# Altium schematic sheet MAIN_DRIVER.SchDoc
size A3; SheetNumber: 1; SheetTotal: 3
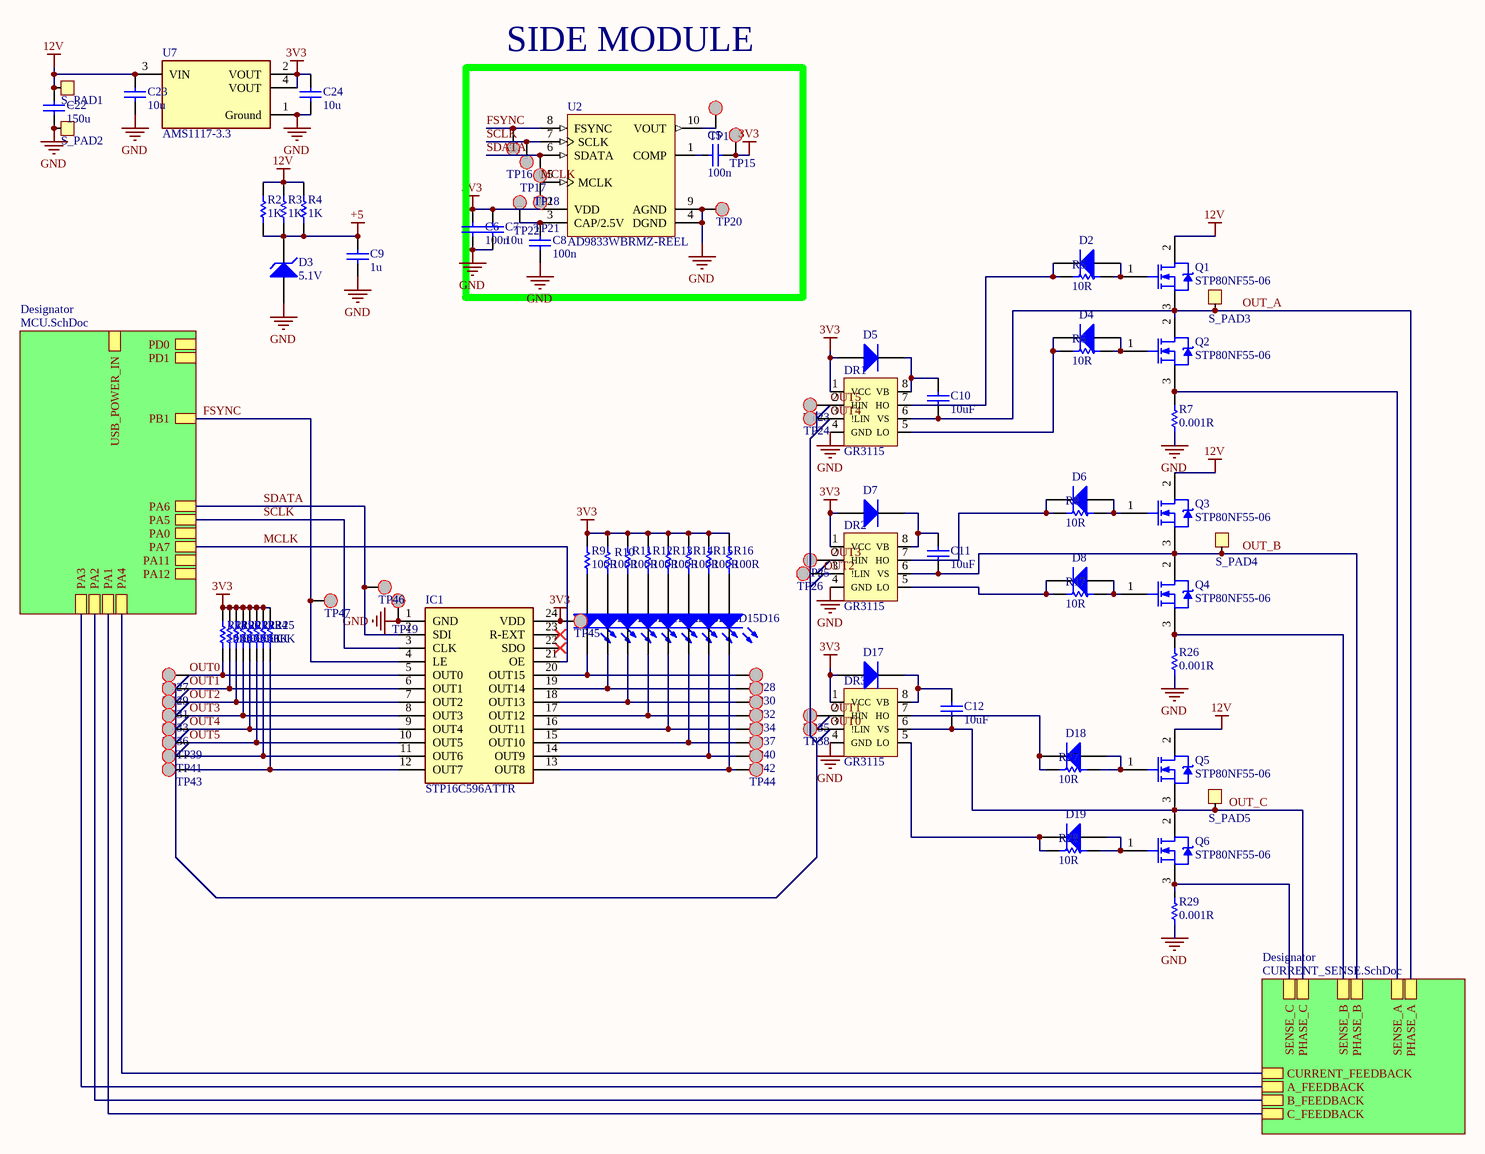
[diagram p0: MAIN_DRIVER.SchDoc]

## Parts
C5  value 100n  [CAP FILM 0603_1608]  (hidden comment: Capacitor)
C6  value 100n  [CAP FILM 0603_1608]  (hidden comment: Capacitor)
C7  value 10u  [CAP FILM 0603_1608]  (hidden comment: Capacitor)
C8  value 100n  [CAP FILM 0603_1608]  (hidden comment: Capacitor)
C9  value 1u  [CAP FILM 0603_1608]  (hidden comment: Capacitor)
C10  value 10uF  [CAP FILM 0603_1608]  (hidden comment: Capacitor)
C11  value 10uF  [CAP FILM 0603_1608]  (hidden comment: Capacitor)
C12  value 10uF  [CAP FILM 0603_1608]  (hidden comment: Capacitor)
C22  value 150u  [CAPAE7266X80M]  (hidden comment: Capacitor)
C23  value 10u  [CAP FILM 0805]  (hidden comment: Capacitor)
C24  value 10u  [CAP FILM 0805]  (hidden comment: Capacitor)
D2  1N4148  [SODFL375X135-2N]  (value not drawn)
D3  BV: 5.1V  [DIOMELF3514N]  (hidden comment: Zener Diode)
D4  1N4148  [SODFL375X135-2N]  (value not drawn)
D5  Diode  [SODFL365X110-2N]  (value not drawn)
D6  1N4148  [SODFL375X135-2N]  (value not drawn)
D7  Diode  [SODFL365X110-2N]  (value not drawn)
D8  1N4148  [SODFL375X135-2N]  (value not drawn)
D9  Light-Emitting Diode  [RES 0603_1608]  (value not drawn)
D10  Light-Emitting Diode  [RES 0603_1608]  (value not drawn)
D11  Light-Emitting Diode  [RES 0603_1608]  (value not drawn)
D12  Light-Emitting Diode  [RES 0603_1608]  (value not drawn)
D13  Light-Emitting Diode  [RES 0603_1608]  (value not drawn)
D14  Light-Emitting Diode  [RES 0603_1608]  (value not drawn)
D15  Light-Emitting Diode  [RES 0603_1608]  (value not drawn)
D16  Light-Emitting Diode  [RES 0603_1608]  (value not drawn)
D17  Diode  [SODFL365X110-2N]  (value not drawn)
D18  1N4148  [SODFL375X135-2N]  (value not drawn)
D19  1N4148  [SODFL375X135-2N]  (value not drawn)
DR1  GR3115  [PCBComponent_1]
DR2  GR3115  [PCBComponent_1]
DR3  GR3115  [PCBComponent_1]
IC1  STP16C596ATTR  [SOP65P638X110-24N]
Q1  STP80NF55-06  [STM-TO-220A-3]
Q2  STP80NF55-06  [STM-TO-220A-3]
Q3  STP80NF55-06  [STM-TO-220A-3]
Q4  STP80NF55-06  [STM-TO-220A-3]
Q5  STP80NF55-06  [STM-TO-220A-3]
Q6  STP80NF55-06  [STM-TO-220A-3]
R2  value 1K  [RES 0603_1608]  (hidden comment: Resistor)
R3  value 1K  [RES 0603_1608]  (hidden comment: Resistor)
R4  value 1K  [RES 0603_1608]  (hidden comment: Resistor)
R5  value 10R  [RES 0603_1608]  (hidden comment: Resistor)
R6  value 10R  [RES 0603_1608]  (hidden comment: Resistor)
R7  value 0.001R  [RES 1206_3216]  (hidden comment: Resistor)
R8  value 10R  [RES 0603_1608]  (hidden comment: Resistor)
R9  value 100R  [RES 0603_1608]  (hidden comment: Resistor)
R10  value 100R  [RES 0603_1608]  (hidden comment: Resistor)
R11  value 100R  [RES 0603_1608]  (hidden comment: Resistor)
R12  value 100R  [RES 0603_1608]  (hidden comment: Resistor)
R13  value 100R  [RES 0603_1608]  (hidden comment: Resistor)
R14  value 100R  [RES 0603_1608]  (hidden comment: Resistor)
R15  value 100R  [RES 0603_1608]  (hidden comment: Resistor)
R16  value 100R  [RES 0603_1608]  (hidden comment: Resistor)
R17  value 10R  [RES 0603_1608]  (hidden comment: Resistor)
R18  value 10K  [RES 0603_1608]  (hidden comment: Resistor)
R19  value 10K  [RES 0603_1608]  (hidden comment: Resistor)
R20  value 10K  [RES 0603_1608]  (hidden comment: Resistor)
R21  value 10K  [RES 0603_1608]  (hidden comment: Resistor)
R22  value 10K  [RES 0603_1608]  (hidden comment: Resistor)
R23  value 10K  [RES 0603_1608]  (hidden comment: Resistor)
R24  value 10K  [RES 0603_1608]  (hidden comment: Resistor)
R25  value 10K  [RES 0603_1608]  (hidden comment: Resistor)
R26  value 0.001R  [RES 1206_3216]  (hidden comment: Resistor)
R27  value 10R  [RES 0603_1608]  (hidden comment: Resistor)
R28  value 10R  [RES 0603_1608]  (hidden comment: Resistor)
R29  value 0.001R  [RES 1206_3216]  (hidden comment: Resistor)
S_PAD1  SOLDER_PAD  [POWER_PAD]  (value not drawn)
S_PAD2  SOLDER_PAD  [POWER_PAD]  (value not drawn)
S_PAD3  SOLDER_PAD  [POWER_PAD]  (value not drawn)
S_PAD4  SOLDER_PAD  [POWER_PAD]  (value not drawn)
S_PAD5  SOLDER_PAD  [POWER_PAD]  (value not drawn)
TP14  (no value)  [ROUND_SMALL]
TP15  (no value)  [ROUND_SMALL]
TP16  (no value)  [ROUND_SMALL]
TP17  (no value)  [ROUND_SMALL]
TP18  (no value)  [ROUND_SMALL]
TP19  (no value)  [ROUND_SMALL]
TP20  (no value)  [ROUND_SMALL]
TP21  (no value)  [ROUND_SMALL]
TP22  (no value)  [ROUND_SMALL]
TP23  (no value)  [ROUND_SMALL]
TP24  (no value)  [ROUND_SMALL]
TP25  (no value)  [ROUND_SMALL]
TP26  (no value)  [ROUND_SMALL]
TP27  (no value)  [ROUND_SMALL]
TP28  (no value)  [ROUND_SMALL]
TP29  (no value)  [ROUND_SMALL]
TP30  (no value)  [ROUND_SMALL]
TP31  (no value)  [ROUND_SMALL]
TP32  (no value)  [ROUND_SMALL]
TP33  (no value)  [ROUND_SMALL]
TP34  (no value)  [ROUND_SMALL]
TP35  (no value)  [ROUND_SMALL]
TP36  (no value)  [ROUND_SMALL]
TP37  (no value)  [ROUND_SMALL]
TP38  (no value)  [ROUND_SMALL]
TP39  (no value)  [ROUND_SMALL]
TP40  (no value)  [ROUND_SMALL]
TP41  (no value)  [ROUND_SMALL]
TP42  (no value)  [ROUND_SMALL]
TP43  (no value)  [ROUND_SMALL]
TP44  (no value)  [ROUND_SMALL]
TP45  (no value)  [ROUND_SMALL]
TP46  (no value)  [ROUND_SMALL]
TP47  (no value)  [ROUND_SMALL]
U2  AD9833WBRMZ-REEL  [ADI-RM-10_M]
U7  AMS1117-3.3  [FP-AMS1117-IPC_C]

## Blocks framed on the sheet
SIDE MODULE: C5-C8 TP14-TP18 TP20-TP22 U2

## Sub-sheets
Designator = MCU.SchDoc: USB_POWER_IN, PD0, PD1, PB1, PA5, PA6, PA7, PA11, PA12, PA1, PA2, PA3, PA4, PA0
Designator = CURRENT_SENSE.SchDoc: SENSE_A, SENSE_B, SENSE_C, PHASE_A, PHASE_B, PHASE_C, CURRENT_FEEDBACK, A_FEEDBACK, B_FEEDBACK, C_FEEDBACK

## Nets
3V3: C5.2 C6.2 C7.1 C24.2 D5.1(A) D7.1(A) D17.1(A) DR1.1(VCC) DR2.1(VCC) DR3.1(VCC) IC1.24(VDD) R9.2 R10.2 R11.2 R12.2 R13.2 R14.2 R15.2 R16.2 R18.2 R19.2 R20.2 R21.2 R22.2 R23.2 R24.2 R25.2 TP15.1(Test_Point) TP45.1(Test_Point) U2.2(VDD) U7.2(VOUT) U7.4(VOUT)
12V: C22.2 C23.2 Q1.2(D) Q3.2(D) Q5.2(D) R2.2 R3.2 R4.2 S_PAD1.1 U7.3(VIN)
+5: C9.2 D3.2(K) R2.1 R3.1 R4.1
GND: C6.1 C7.2 C8.1 C9.1 C22.1 C23.1 C24.1 D3.1(A) DR1.4(GND) DR2.4(GND) DR3.4(GND) IC1.1(GND) R7.1 R26.1 R29.1 S_PAD2.1 TP19.1(Test_Point) TP20.1(Test_Point) U2.4(DGND) U2.9(AGND) U7.1(Ground)
FSYNC: IC1.4(LE) TP16.1(Test_Point) TP47.1(Test_Point) U2.8(FSYNC) ; sheet Designator/PB1
MCLK: IC1.21(OE) TP21.1(Test_Point) U2.5(MCLK) ; sheet Designator/PA7
OUT0: DR3.3(!LIN) IC1.5(OUT0) R18.1 TP27.1(Test_Point) TP38.1(Test_Point)
OUT1: DR3.2(HIN) IC1.6(OUT1) R19.1 TP29.1(Test_Point) TP35.1(Test_Point)
OUT2: DR2.3(!LIN) IC1.7(OUT2) R20.1 TP26.1(Test_Point) TP31.1(Test_Point)
OUT3: DR2.2(HIN) IC1.8(OUT3) R21.1 TP25.1(Test_Point) TP33.1(Test_Point)
OUT4: DR1.3(!LIN) IC1.9(OUT4) R22.1 TP24.1(Test_Point) TP36.1(Test_Point)
OUT5: DR1.2(HIN) IC1.10(OUT5) R23.1 TP23.1(Test_Point) TP39.1(Test_Point)
OUT_A: C10.1 DR1.6(VS) Q1.3(S) Q2.2(D) S_PAD3.1 ; sheet Designator/PHASE_A
OUT_B: C11.2 DR2.6(VS) Q3.3(S) Q4.2(D) S_PAD4.1 ; sheet Designator/PHASE_B
OUT_C: C12.1 DR3.6(VS) Q5.3(S) Q6.2(D) S_PAD5.1 ; sheet Designator/PHASE_C
SCLK: IC1.3(CLK) TP17.1(Test_Point) U2.7(SCLK) ; sheet Designator/PA5
SDATA: IC1.2(SDI) TP18.1(Test_Point) TP46.1(Test_Point) U2.6(SDATA) ; sheet Designator/PA6
NetC5_1: C5.1 U2.1(COMP)
NetC8_2: C8.2 TP22.1(Test_Point) U2.3(CAP/2.5V)
NetC10_2: C10.2 D5.2(K) DR1.8(VB)
NetC11_1: C11.1 D7.2(K) DR2.8(VB)
NetC12_2: C12.2 D17.2(K) DR3.8(VB)
NetD2_1: D2.1(A) Q1.1(G) R5.2
NetD2_2: D2.2(K) DR1.7(HO) R5.1
NetD4_1: D4.1(A) Q2.1(G) R6.2
NetD4_2: D4.2(K) DR1.5(LO) R6.1
NetD6_1: D6.1(A) Q3.1(G) R8.2
NetD6_2: D6.2(K) DR2.7(HO) R8.1
NetD8_1: D8.1(A) Q4.1(G) R17.2
NetD8_2: D8.2(K) DR2.5(LO) R17.1
NetD9_1: D9.1(A) R9.1
NetD9_2: D9.2(K) IC1.20(OUT15) TP28.1(Test_Point)
NetD10_1: D10.1(A) R10.1
NetD10_2: D10.2(K) IC1.19(OUT14) TP30.1(Test_Point)
NetD11_1: D11.1(A) R11.1
NetD11_2: D11.2(K) IC1.18(OUT13) TP32.1(Test_Point)
NetD12_1: D12.1(A) R12.1
NetD12_2: D12.2(K) IC1.17(OUT12) TP34.1(Test_Point)
NetD13_1: D13.1(A) R13.1
NetD13_2: D13.2(K) IC1.16(OUT11) TP37.1(Test_Point)
NetD14_1: D14.1(A) R14.1
NetD14_2: D14.2(K) IC1.15(OUT10) TP40.1(Test_Point)
NetD15_1: D15.1(A) R15.1
NetD15_2: D15.2(K) IC1.14(OUT9) TP42.1(Test_Point)
NetD16_1: D16.1(A) R16.1
NetD16_2: D16.2(K) IC1.13(OUT8) TP44.1(Test_Point)
NetD18_1: D18.1(A) Q5.1(G) R27.2
NetD18_2: D18.2(K) DR3.7(HO) R27.1
NetD19_1: D19.1(A) Q6.1(G) R28.2
NetD19_2: D19.2(K) DR3.5(LO) R28.1
NetIC1_11: IC1.11(OUT6) R24.1 TP41.1(Test_Point)
NetIC1_12: IC1.12(OUT7) R25.1 TP43.1(Test_Point)
NetQ2_3: Q2.3(S) R7.2 ; sheet Designator/SENSE_A
NetQ4_3: Q4.3(S) R26.2 ; sheet Designator/SENSE_B
NetQ6_3: Q6.3(S) R29.2 ; sheet Designator/SENSE_C
NetTP14_1: TP14.1(Test_Point) U2.10(VOUT)
(unnamed): sheet Designator/PA1, sheet Designator/C_FEEDBACK
(unnamed): sheet Designator/PA2, sheet Designator/B_FEEDBACK
(unnamed): sheet Designator/PA3, sheet Designator/A_FEEDBACK
(unnamed): sheet Designator/PA4, sheet Designator/CURRENT_FEEDBACK

Not connected (* = marked no-connect by the designer): IC1 22(SDO)* 23(R-EXT)*

## Library data of the parts
C5-C12 C22-C24 = Capacitor: SimulationGenericComponent: True
D2 D4-D8 D17-D19 = Diode: AF: 1; BV: 0; BV_MAX: 1e99; EG: 1.11; FC: 0.5; IBV: 0.001; ISR: 1e-14; MJSW: 0.33; NTUN: 30; TNOM: 27; XTI: 3; SimulationGenericComponent: True; CJO: 0; CJP: 0; CTA: 0; CTP: 0; FCS: 0.5; FV_MAX: 1e99; IKF: 0; IKR: 0; JSW: 0; JTUN: 0; JTUNSW: 0; KEG: 1; KF: 0; LEVEL: 1; N: 1; NBV: 1; NR: 1; NS: 1; PHP: 1; RS: 0; TCV: 0; TLEV: 0; TLEVC: 0; TM1: 0; TM2: 0; TPB: 0; TPHP: 0; TRS: 0; TRS2: 0; TT: 0; TTT1: 0; TTT2: 0; VJ: 1; XTITUN: 3; IS: 1e-14
D3 = Zener Diode: AF: 1; BV_MAX: 1e99; CJO: 0; EG: 1.11; FC: 0.5; IBV: 0.001; IS: 1e-14; MJSW: 0.33; NTUN: 30; TNOM: 27; XTI: 3; SimulationGenericComponent: True; CJP: 0; CTA: 0; CTP: 0; FCS: 0.5; FV_MAX: 1e99; IKF: 0; IKR: 0; ISR: 1e-14; JSW: 0; JTUN: 0; JTUNSW: 0; KEG: 1; KF: 0; LEVEL: 1; N: 1; NBV: 1; NR: 1; NS: 1; PHP: 1; RS: 0; TCV: 0; TLEV: 0; TLEVC: 0; TM1: 0; TM2: 0; TPB: 0; TPHP: 0; TRS: 0; TRS2: 0; TT: 0; TTT1: 0; TTT2: 0; VJ: 1; XTITUN: 3
D9-D16 = LED: AF: 1; BV: 0; BV_MAX: 1e99; EG: 1.11; FC: 0.5; IBV: 0.001; IS: 1e-14; MJSW: 0.33; NTUN: 30; TNOM: 27; XTI: 3; SimulationGenericComponent: True; CJO: 0; CJP: 0; CTA: 0; CTP: 0; FCS: 0.5; FV_MAX: 1e99; IKF: 0; IKR: 0; ISR: 1e-14; JSW: 0; JTUN: 0; JTUNSW: 0; KEG: 1; KF: 0; LEVEL: 1; N: 1; NBV: 1; NR: 1; NS: 1; PHP: 1; RS: 0; TCV: 0; TLEV: 0; TLEVC: 0; TM1: 0; TM2: 0; TPB: 0; TPHP: 0; TRS: 0; TRS2: 0; TT: 0; TTT1: 0; TTT2: 0; VJ: 1; XTITUN: 3
IC1 = STP16C596ATTR: Integrated Circuit; Manufacturer_Name: STMicroelectronics; Datasheet Link: https://www.st.com/resource/en/datasheet/cd00005085.pdf; Height: 1.1mm; Manufacturer_Part_Number: STP16C596ATTR; Mouser Part Number: N/A; Mouser Price/Stock: https://www.mouser.co.uk/ProductDetail/STMicroelectronics/STP16C596ATTR?qs=y2Ae8b0edtM6tyumk2sS7g%3D%3D
Q1-Q6 = CMP-2000-07168-1: N-Channel STripFET(TM) II Power MOSFET, 55 V, 80 A, 5 mOhm, -55 to 175 degC, 3-Pin TO-220, RoHS, Tube; Manufacturer: STMicroelectronics; Minimum Gate Threshold Voltage: 2V; Maximum Gate Threshold Voltage: 4V; Channel Type: N; Maximum Drain Source Voltage: 55V; Transistor Configuration: Single; Maximum Drain Source Resistance: 0.007Ω; Number of Elements per Chip: 1; Maximum Continuous Drain Current: 80A; Typical Gate Charge @ Vgs: 142nC@10V; Channel Mode: Enhancement; Typical Turn-Off Delay Time: 125ns; Maximum Gate Source Voltage: ±20V; Transistor Material: Si; Maximum Power Dissipation: 300W; Typical Input Capacitance @ Vds: 4400pF@25V; Typical Turn-On Delay Time: 27ns; Length: 10.4mm; Datasheet Version: Rev. 8, 10/2006; Package Type: TO-220; Minimum Operating Temperature: -55°C; Pin Count: 3; Package Description: 3-Pin Transistor Outline Package, 10.2 x 4.5 mm, Pitch 2.55 mm; Mounting Type: ThroughHole; Datasheet URL: http://www.st.com/content/ccc/resource/technical/document/datasheet/f1/46/49/9e/39/8f/49/aa/CD00002670.pdf/files/CD00002670.pdf/jcr:content/translations/en.CD00002670.pdf; Manufacturer URL: http://www.st.com/; Package URL: http://www.st.com/st-web-ui/static/active/en/resource/technical/document/datasheet/CD00000544.pdf; Height: 9.15mm; Width: 4.6mm; Dimensions: 10.4x4.6x9.15mm; Maximum Operating Temperature: +175°C; Category: PowerMOSFET; Package Reference: TO-220; Mounting Technology: ThroughHole
R2-R29 = Resistor: TC1: 0; SimulationGenericComponent: True; TC2: 0
TP14-TP47 = TEST_PAD
U2 = CMP-0293-00078-1: Low Power, 12.65 mW, 2.3 V to 5.5 V, Programmable Waveform Generator, 10-Bit, Serial, RM-10, 3000 Reel, Pb-Free; Master fclk: 25MHz; Tuning Word Width (bits): 28bit; FS Iout (mA nom): 3mA; REFCLK Multiplier: No; Compliance Range (V): 650mV; Resolution (Bits): 10bit; I Supply total (max): 5.5mA; I/O Interface: Serial; ComponentLink3Description: Package Specification; Code_JEDEC: MO-187-BA; ComponentLink2URL: http://www.analog.com/static/imported-files/data_sheets/AD9833.pdf; PackageReference: RM-10; ComponentLink3URL: http://www.analog.com/static/imported-files/packages/PKG_PDF/MSOP%28RM%29/RM_10.pdf; ComponentLink1URL: www.analog.com; DatasheetVersion: Rev. D; PackageVersion: 5/8/2005; ComponentLink2Description: Datasheet; ComponentLink1Description: Manufacturer URL; PackageDescription: 10-Lead Mini Small Outline Package [MSOP]
U7 = CMP-209535-000001-1: LDO Voltage Regulators 1A, 3.3V; Manufacturer: Advanced Monolithic Systems; Dropout Voltage: 1.1V; Output Type: Fixed; Nominal Supply Current: 5mA; Max Power Dissipation: 1.2W; Max Supply Voltage: 15V; Number Of Outputs: 1; Standoff Height: 0.64mm; Max Junction Temp: +125°C; Height: 1.8mm; Package: AMS1117; Device Class L2: Power Management ICs; ComponentLink2Description: Datasheet; ComponentLink2URL: http://www.advanced-monolithic.com/pdf/ds1117.pdf; Category: IC; RoHS: TRUE; Automotive: No; Device Class L1: Integrated Circuits (ICs); Output Current: 1A; Device Class L3: Voltage Regulators - Linear; Temperature: -40°C to +125°C; Output Voltage: 3.3V; Manufacturer Part Number: AMS1117-3.3; Temperature Range Low: -40°C; Octopart: https://octopart.com/ams1117-3.3-advanced+monolithic+systems-25899300; Lead Free: Yes; Ipc Land Pattern Name: SOT229P700X180-4; Temperature Range High: +125°C